# Altium project Programmer.PrjPcb
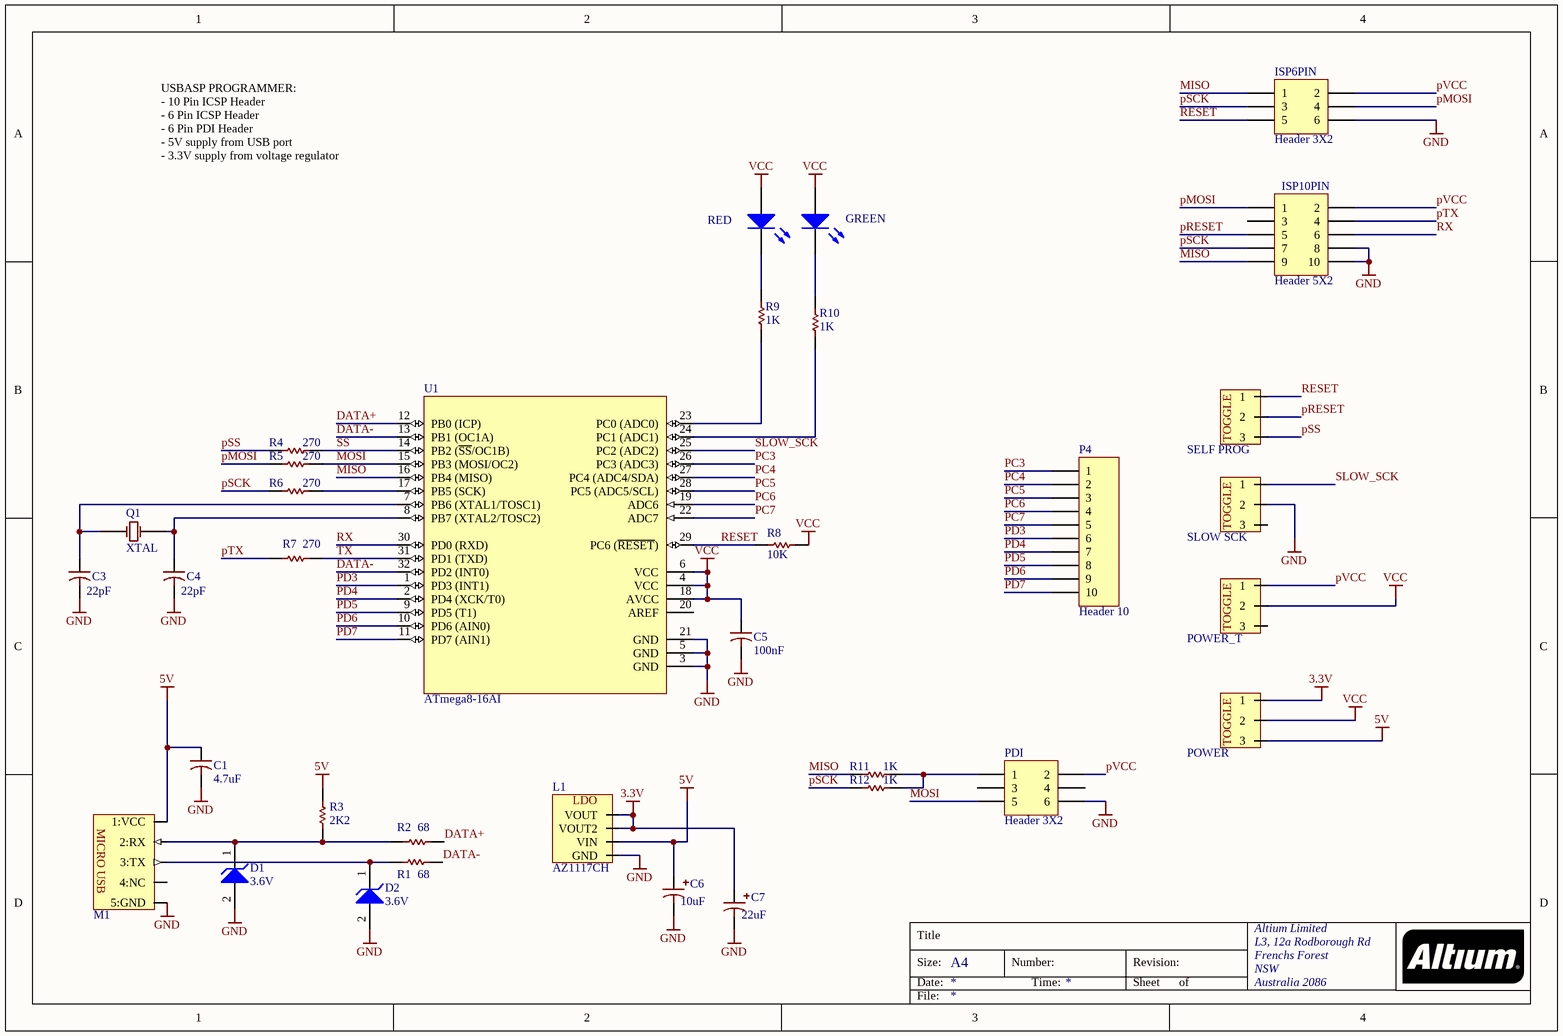
[diagram p0: programmer.SchDoc]
1 sheet, 34 parts. Net scope: global (net labels, ports and power ports of the same name join across sheets).
Board file: programmer.PcbDoc

## Sheet programmer.SchDoc
size A4; Organization: Altium Limited; Address1: L3, 12a Rodborough Rd; Address2: Frenchs Forest; Address3: NSW; Address4: Australia 2086

### Parts
C1  value 4.7uF  [CAP4]  (hidden comment: CAP)
C3  value 22pF  [0805]  (hidden comment: CAP)
C4  value 22pF  [0805]  (hidden comment: CAP)
C5  value 100nF  [0805]  (hidden comment: CAP)
C6  value 10uF  [CAP5]  (hidden comment: CAP5)
C7  value 22uF  [CAP5]  (hidden comment: CAP5)
D1  3.6V  [ONSC-SOD-123-2-425-04_V]
D2  3.6V  [ONSC-SOD-123-2-425-04_V]
GREEN  LED3  [3.5X2.8X1.9]  (value not drawn)
ISP6PIN  Header 3X2  [HDR2X3]
ISP10PIN  Header 5X2  [HDR2X5]
L1  AZ1117CH  [SOT-223-DB3_L]
M1  uUSB_I  [MICROUSB_B]  (value not drawn)
P4  Header 10  [HDR1X10]
PDI  Header 3X2  [HDR2X3]
POWER  TOGGLE SWITCH  [TOGGLE SWITCH]  (value not drawn)
POWER_T  TOGGLE SWITCH  [TOGGLE SWITCH]  (value not drawn)
Q1  XTAL  [CRYSTAL]
R1  value 68  [0805]  (hidden comment: RES)
R2  value 68  [0805]  (hidden comment: RES)
R3  value 2K2  [0805]  (hidden comment: RES)
R4  value 270  [0805]  (hidden comment: RES)
R5  value 270  [0805]  (hidden comment: RES)
R6  value 270  [0805]  (hidden comment: RES)
R7  value 270  [0805]  (hidden comment: RES)
R8  value 10K  [0805]  (hidden comment: RES)
R9  value 1K  [0805]  (hidden comment: RES)
R10  value 1K  [0805]  (hidden comment: RES)
R11  value 1K  [0805]  (hidden comment: RES)
R12  value 1K  [0805]  (hidden comment: RES)
RED  LED3  [3.5X2.8X1.9]  (value not drawn)
SELF_PROG  TOGGLE SWITCH  [TOGGLE SWITCH]  (value not drawn)
SLOW_SCK  TOGGLE SWITCH  [TOGGLE SWITCH]  (value not drawn)
U1  ATmega8-16AI  [32A_N]

### Nets
3.3V: C7.2 L1.VOUT L1.VOUT2 POWER.1
5V: C1.1 C6.2 L1.VIN M1.0(1:VCC) POWER.3 R3.1
GND: C1.2 C3.2 C4.2 C5.2 C6.1 C7.1 D1.2(A) D2.2(A) ISP6PIN.6 ISP10PIN.8 ISP10PIN.10 L1.GND M1.4(5:GND) PDI.6 SLOW_SCK.2 U1.3(GND) U1.5(GND) U1.21(GND)
VCC: C5.1 GREEN.1(A) POWER.2 POWER_T.2 R8.2 RED.1(A) U1.4(VCC) U1.6(VCC) U1.18(AVCC)
DATA+: R2.2 U1.12(PB0_(ICP))
DATA-: R1.2 U1.13(PB1_(OC1A)) U1.32(PD2_(INT0))
MISO: ISP6PIN.1 ISP10PIN.9 R11.2 U1.16(PB4_(MISO))
MOSI: PDI.5 R5.2 U1.15(PB3_(MOSI/OC2))
PC3: P4.1 U1.26(PC3_(ADC3))
PC4: P4.2 U1.27(PC4_(ADC4/SDA))
PC5: P4.3 U1.28(PC5_(ADC5/SCL))
PC6: P4.4 U1.19(ADC6)
PC7: P4.5 U1.22(ADC7)
PD3: P4.6 U1.1(PD3_(INT1))
PD4: P4.7 U1.2(PD4_(XCK/T0))
PD5: P4.8 U1.9(PD5_(T1))
PD6: P4.9 U1.10(PD6_(AIN0))
PD7: P4.10 U1.11(PD7_(AIN1))
pMOSI: ISP6PIN.4 ISP10PIN.1 R5.1
pRESET: ISP10PIN.5 SELF_PROG.2
pSCK: ISP6PIN.3 ISP10PIN.7 R6.1 R12.2
pSS: R4.1 SELF_PROG.3
pTX: ISP10PIN.4 R7.1
pVCC: ISP6PIN.2 ISP10PIN.2 PDI.2 POWER_T.1
RESET: ISP6PIN.5 R8.1 SELF_PROG.1 U1.29(PC6_(~{RESET}))
RX: ISP10PIN.6 U1.30(PD0_(RXD))
SLOW_SCK: SLOW_SCK.1 U1.25(PC2_(ADC2))
SS: R4.2 U1.14(PB2_(~{SS}/OC1B))
TX: R7.2 U1.31(PD1_(TXD))
NetC3_1: C3.1 Q1.1(OSC1) U1.7(PB6_(XTAL1/TOSC1))
NetC4_1: C4.1 Q1.2(OSC2) U1.8(PB7_(XTAL2/TOSC2))
NetD1_1: D1.1(K) M1.1(2:RX) R2.1 R3.2
NetD2_1: D2.1(K) M1.2(3:TX) R1.1
NetGREEN_2: GREEN.2(K) R10.1
NetPDI_1: PDI.1 R11.1 R12.1
NetR6_2: R6.2 U1.17(PB5_(SCK))
NetR9_1: R9.1 RED.2(K)
NetR9_2: R9.2 U1.23(PC0_(ADC0))
NetR10_2: R10.2 U1.24(PC1_(ADC1))

Not connected (* = marked no-connect by the designer): ISP10PIN 3; M1 3(4:NC); PDI 3 4; POWER_T 3; SLOW_SCK 3; U1 20(AREF)

### Notes on the sheet
- USBASP PROGRAMMER:
  - 10 Pin ICSP Header
  - 6 Pin ICSP Header
  - 6 Pin PDI Header
  - 5V supply from USB port
  - 3.3V supply from voltage regulator
- Title
- Size:
- Date:
- A4
- Number:
- Time:
- Revision:
- Sheet
- of
- File:
- (in symbol AZ1117CH) LDO
- (in symbol TOGGLE SWITCH) TOGGLE
- (in symbol uUSB_I) MICRO USB

### Library data of the parts
C1 C3-C5 = CAP: Capacitor - Imperial Units; Published: 23-Sep-2002; PackageReference: CAPR5-4X5; Publisher: Altium Limited; PackageDescription: Capacitor; 2 Leads
C6 C7 = CAP5: Aluminum Capacitor - Imperial Units; Published: 23-Sep-2002; PackageReference: CAPR5-4X5; Publisher: Altium Limited; PackageDescription: Capacitor; 2 Leads
D1 D2 = MMSZ4685T1G: Zener Voltage Regulator, 500 mW, 2-Pin SOD-123, Pb-Free, Tape and Reel; Manufacturer: On Semiconductor; P Max (W): 0.5; VZ Typ (V): 3.6; DatasheetVersion: Rev. 9; PackageVersion: Rev. G, 10/2009; PackageReference: SOD-123-2-425-04; PackageDescription: 2-Pin SOD, Body 1.6 x 2.69 mm; Supplier 1: Digi-Key; Supplier Part Number 1: MMSZ4685T1GOSTR-ND; Supplier 2: Digi-Key; Supplier Part Number 2: MMSZ4685T1GOSCT-ND; Supplier 3: Digi-Key; Supplier Part Number 3: MMSZ4685T1GOSDKR-ND; Supplier 4: Farnell; Supplier Part Number 4: 1651592; Supplier 5: Farnell; Supplier Part Number 5: 1651592RL; Supplier 6: Newark; Supplier Part Number 6: 45J1579; Supplier 7: Mouser; Supplier Part Number 7: 863-MMSZ4685T1G; Packing: Tape and Reel; RoHS: Pb-Free; Mounting Technology: Surface Mount; PartNumber: MMSZ4685T1G; ComponentLink1Description: Manufacturer URL; ComponentLink1URL: http://www.onsemi.com/; ComponentLink2Description: Datasheet; ComponentLink2URL: http://www.onsemi.com/pub_link/Collateral/MMSZ4678T1-D.PDF; ComponentLink3Description: Package Specification; ComponentLink3URL: http://www.onsemi.com/pub_link/Collateral/425-04.PDF
GREEN RED = LED3: Typical BLUE SiC LED; Published: 8-Jun-2000; LatestRevisionDate: 17-Dec-2003; LatestRevisionNote: PCB Footprint replaced.; DatasheetVersion: 16-Apr-2002; PackageVersion: 16-Apr-2002; PackageReference: 3.5X2.8X1.9; Publisher: Altium Limited; PackageDescription: SM LED; 2 C-Bend Leads; Body 3.5 x 2.8 x 1.9 mm, inc leads (LxWxH typ)
ISP6PIN PDI = Header 3X2: Header, 3-Pin, Dual row; LatestRevisionDate: 17-Jul-2002; LatestRevisionNote: Re-released for DXP Platform.; Publisher: Altium Limited
ISP10PIN = Header 5X2: Header, 5-Pin, Dual row; LatestRevisionDate: 17-Jul-2002; LatestRevisionNote: Re-released for DXP Platform.; Publisher: Altium Limited
L1 = AZ1117CH: Low Dropout Voltage Regulator - Imperial Units; pin to pad: GND>1 VIN>3 VOUT>2 VOUT2>4
M1 = uUSB_I: Micro USB Type B - Imperial Units; pin to pad: 0>1:VCC 1>2:RX 2>3:TX 3>4:NC 4>5:GND
P4 = Header 10: Header, 10-Pin; LatestRevisionDate: 17-Jul-2002; LatestRevisionNote: Re-released for DXP Platform.; Publisher: Altium Limited
POWER POWER_T SELF_PROG SLOW_SCK = TOGGLE SWITCH: Toggle Switch - Imperial Units
Q1 = XTAL: Crystal Oscillator - Imperial Units; Published: 8-Jun-2000; LatestRevisionDate: 17-Jul-2002; LatestRevisionNote: Re-released for DXP Platform.; PackageReference: R38; Publisher: Altium Limited; PackageDescription: Crystal, Thru-Hole; 2 Leads; Body 3.1 x 8.2 mm (Dia.xH)
R1-R12 = RES: Resistor - Imperial Units; Published: 8-Jun-2000; LatestRevisionDate: 17-Jul-2002; LatestRevisionNote: Re-released for DXP Platform.; PackageReference: AXIAL-0.3; Publisher: Altium Limited; PackageDescription: Axial Device, Thru-Hole; 2 Leads; 0.3 in Pin Spacing
U1 = ATmega8-16AI: 8-Bit AVR Microcontroller with 8K Bytes of In-System Programmable Flash Memory; Published: 17-Sep-2003; LatestRevisionDate: 16-Oct-2006; LatestRevisionNote: IPC-7351 Footprint Added.; DatasheetVersion: 2486H-AVR-09/02; PackageVersion: revB, Oct-2001; PackageReference: 32A; Publisher: Altium Limited; PackageDescription: 32-Lead, 7x7x1.0 mm Body, 0.8mm Lead Pitch, Thin Profile Plastic Quad Flat Package (TQFP); Supplier 1: Digi-Key; Supplier Part Number 1: ATMEGA8-16AI-ND; Supplier 2: Mouser; Supplier Part Number 2: 556-ATMEGA8-16AI; Code_JEDEC: MS-026-ABA; ComponentLink1Description: Datasheet; ComponentLink1URL: http://www.atmel.com/dyn/resources/prod_documents/doc2486.pdf; ComponentLink2Description: Atmel.com Home; ComponentLink2URL: http://www.atmel.com